# EAGLE design OTG Splitter (EAGLE 8.6.0)
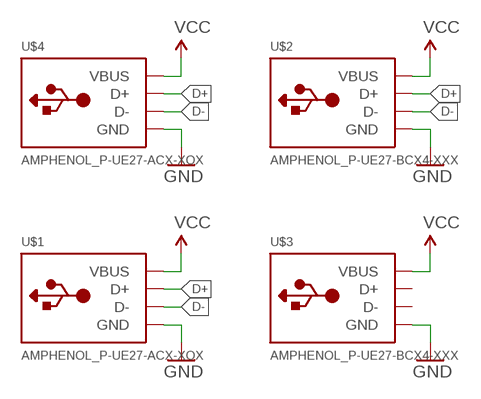
[diagram p0: schematic, sheet 1]

## Parts
U$1  AMPHENOL_P-UE27-ACX-XOX  [USBA_AMPHENOL-UE27-RA]
U$2  AMPHENOL_P-UE27-BCX4-XXX  [USBB_AMPHENOL-UE27-BC]
U$3  AMPHENOL_P-UE27-BCX4-XXX  [USBB_AMPHENOL-UE27-BC]
U$4  AMPHENOL_P-UE27-ACX-XOX  [USBA_AMPHENOL-UE27-RA]

## Nets
D+: U$1.P$3(D+) U$2.P$3(D+) U$4.P$3(D+)
D-: U$1.P$2(D-) U$2.P$2(D-) U$4.P$2(D-)
GND: U$1.P$4(GND) U$2.P$4(GND) U$3.P$4(GND) U$4.P$4(GND)
VCC: U$1.P$1(VBUS) U$2.P$1(VBUS) U$3.P$1(VBUS) U$4.P$1(VBUS)
Unconnected: U$3.P$2(D-) U$3.P$3(D+)

## Library data of the parts
U$1 U$4 = adafruit:AMPHENOL_P-UE27-ACX-XOX
U$2 U$3 = adafruit:AMPHENOL_P-UE27-BCX4-XXX

## Board
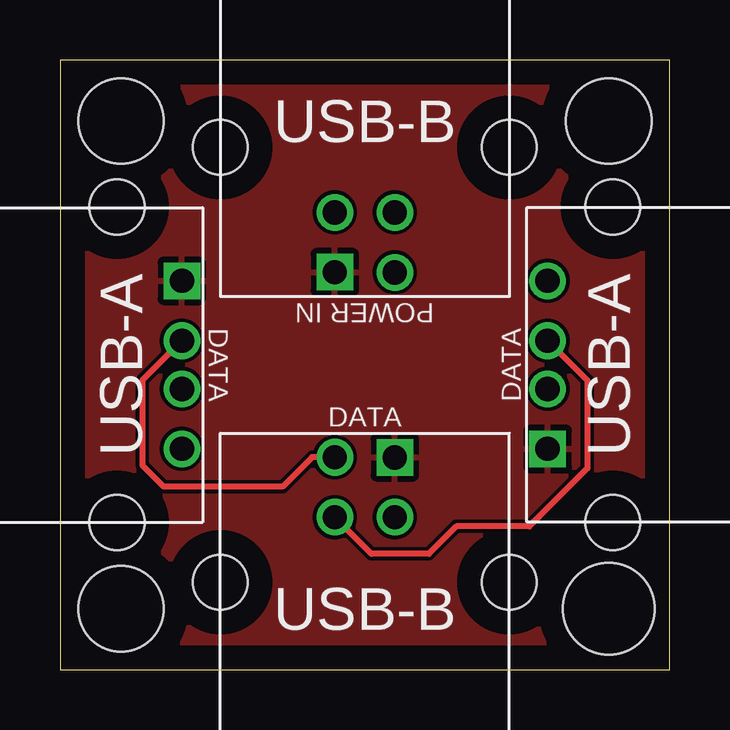
[diagram p1: board, top side]
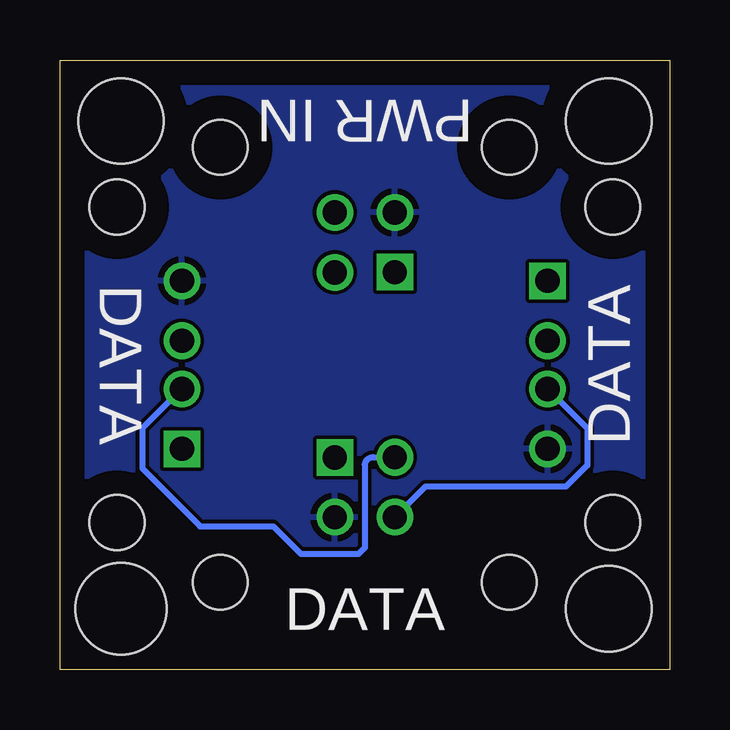
[diagram p2: board, bottom side, seen from below]

Size 25.4 x 25.4 mm. Coordinates in mm from the lower left corner, seen from the top.
Outline: 0,0 25.4,0 25.4,25.4 0,25.4 0,0
Copper layers (1*16): Top 0.035mm / dielectric 1.5mm / Bottom 0.035mm
Design rules "default": minimum track width 6mil, minimum drill 0.35mm, track to track 6mil, track to pad 6mil, pad to pad 6mil, via to via 6mil, smd to smd 6mil, copper to edge 40mil, drill to drill 6mil, minimum pad ring 10mil, minimum via ring 8mil, stop-mask expansion 4mil, vias tented up to drill 0mil, thermal gap 10mil
Holes 3.56 mm at 2.54,22.86 22.86,22.86 2.54,2.54
Holes 3.81 mm at 22.86,2.54

### Footprints (pad centres in the part's own frame; a part is rotated, then mirrored left to right if it is on the bottom)
USBA_AMPHENOL-UE27-RA = drill 1.016 square: P$1 -3.5,0 | drill 1.016: P$2 -1.001,0; P$3 1.001,0; P$4 3.5,0 | hole 2.286: -6.571,-2.71; 6.571,-2.71
USBB_AMPHENOL-UE27-BC = drill 1.016 square: P$1 1.25,2.492 | drill 1.016: P$2 -1.25,2.499; P$3 -1.25,0; P$4 1.25,0 | hole 2.286: -6.02,-2.71; 6.02,-2.71

### Placement (x,y rotation side)
U$1  5.08,12.7 270 top
U$2  12.7,6.35 0 top
U$3  12.7,19.05 180 top
U$4  20.32,12.7 90 top

### Tracks (layer width: path | path; a pad name or v marks a point on that pad's centre or on a via)
D+
  Top 0.254: U$4.P$3 21.97,12.05 21.97,8.38 19.56,5.97 16.51,5.97 15.37,4.83 12.97,4.83 U$2.P$3
  Bottom 0.254: U$1.P$3 3.43,10.05 3.43,8.51 4.32,7.62 10.18,7.62 U$2.P$3
D-
  Top 0.254: U$1.P$2 3.43,12.05 3.43,8.51 4.32,7.62 9.27,7.62 10.5,8.85 U$2.P$2
  Bottom 0.254: U$4.P$2 21.97,10.05 21.97,8.38 19.56,5.97 16.51,5.97 15.37,4.83 12.95,4.83 12.7,5.08 12.7,8.51 arc90 12.36,8.85 U$2.P$2
GND
  pour Bottom: -2.54,27.94 -2.54,-2.54 27.94,-2.54 27.94,27.94
VCC
  pour Top: -1.27,26.67 -1.27,-1.27 26.67,-1.27 26.67,26.67

### Text on the board
tNames: USB-B | POWER IN | USB-A | DATA | DATA | USB-A | DATA | USB-B
bNames: PWR IN | DATA | DATA | DATA